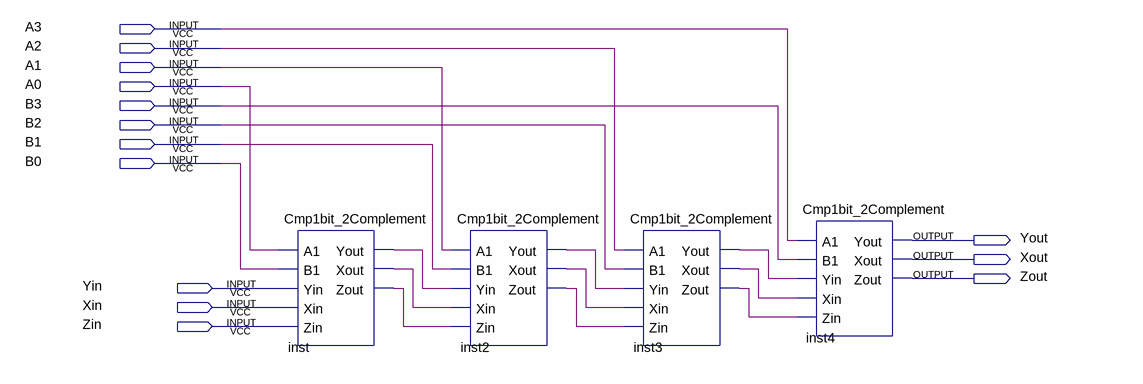
[diagram p0: schematic sheet]
// Quartus schematic Cmp4_2Complement.bdf as structural Verilog: 4 symbols, 14 pins
module Cmp4_2Complement (
  input  A3,
  input  A2,
  input  A1,
  input  A0,
  input  B3,
  input  B2,
  input  B1,
  input  B0,
  input  Yin,
  input  Xin,
  input  Zin,
  output Yout,
  output Xout,
  output Zout
);

  wire inst2_xout, inst2_yout, inst2_zout, inst3_xout, inst3_yout, inst3_zout, inst_xout, inst_yout,
       inst_zout;

  Cmp1bit_2Complement inst (
    .A1(A0), .B1(B0), .Yin(Yin), .Xin(Xin), .Zin(Zin), .Yout(inst_yout), .Xout(inst_xout), .Zout(inst_zout));
  Cmp1bit_2Complement inst2 (
    .A1(A1), .B1(B1), .Yin(inst_yout), .Xin(inst_xout), .Zin(inst_zout), .Yout(inst2_yout),
    .Xout(inst2_xout), .Zout(inst2_zout));
  Cmp1bit_2Complement inst3 (
    .A1(A2), .B1(B2), .Yin(inst2_yout), .Xin(inst2_xout), .Zin(inst2_zout), .Yout(inst3_yout),
    .Xout(inst3_xout), .Zout(inst3_zout));
  Cmp1bit_2Complement inst4 (
    .A1(A3), .B1(B3), .Yin(inst3_yout), .Xin(inst3_xout), .Zin(inst3_zout), .Yout(Yout), .Xout(Xout),
    .Zout(Zout));
endmodule
